# Altium schematic sheet 04_Analog_Part.SchDoc
size A2; SheetNumber: 4; SheetTotal: 5
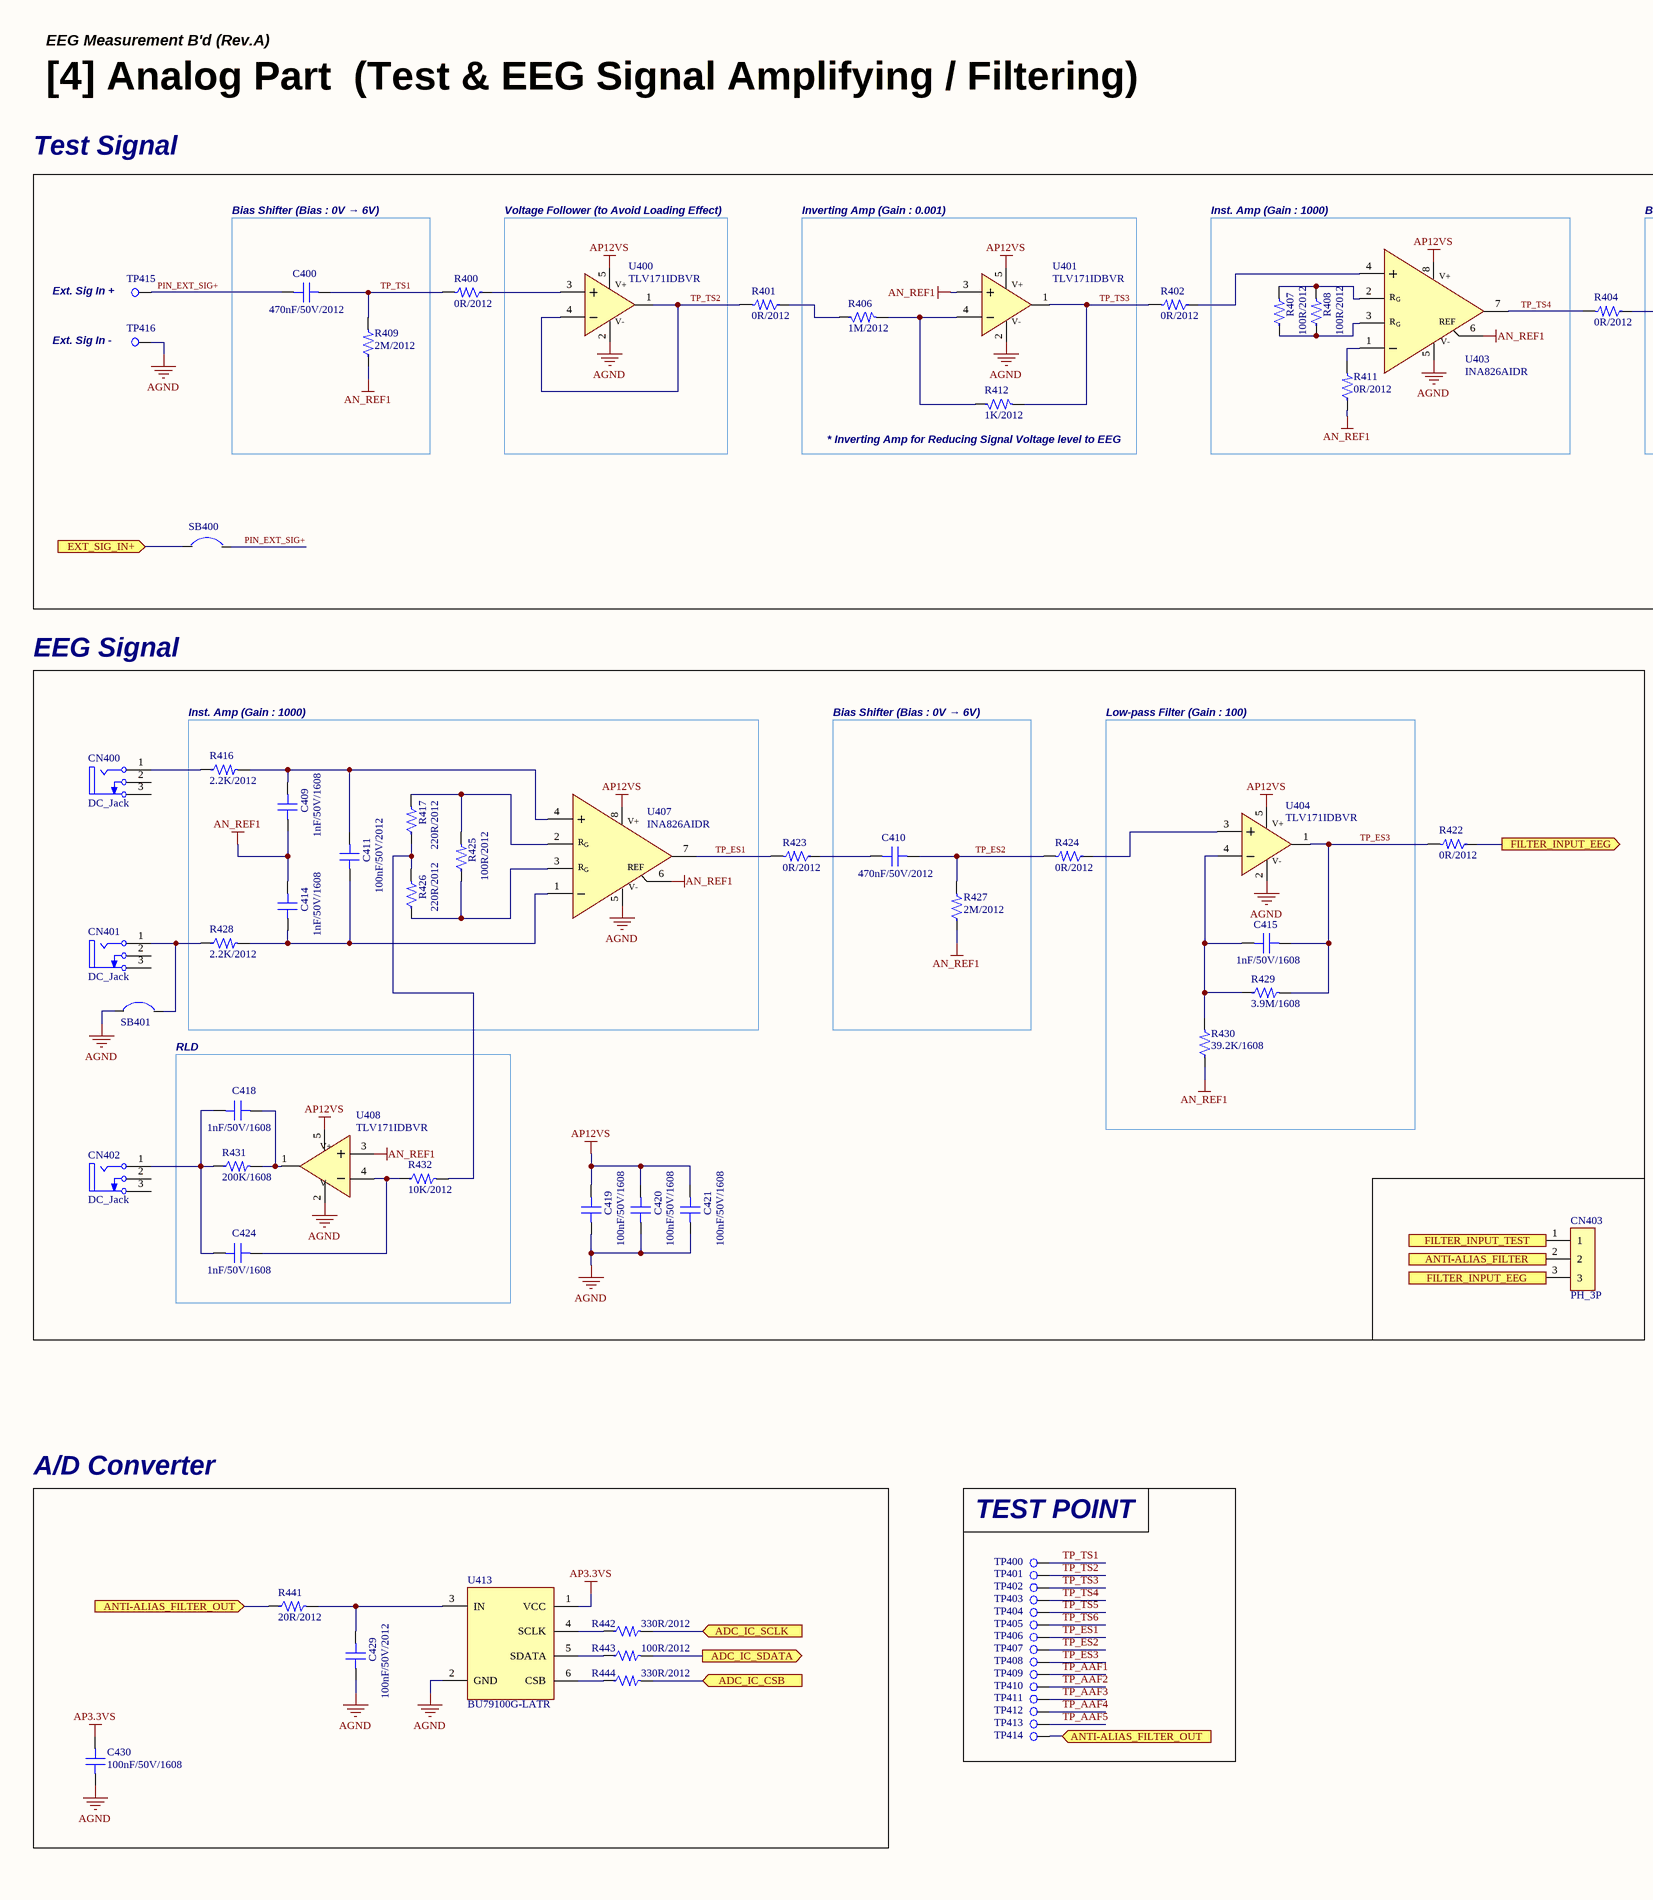
[diagram p0: 04_Analog_Part.SchDoc, left]
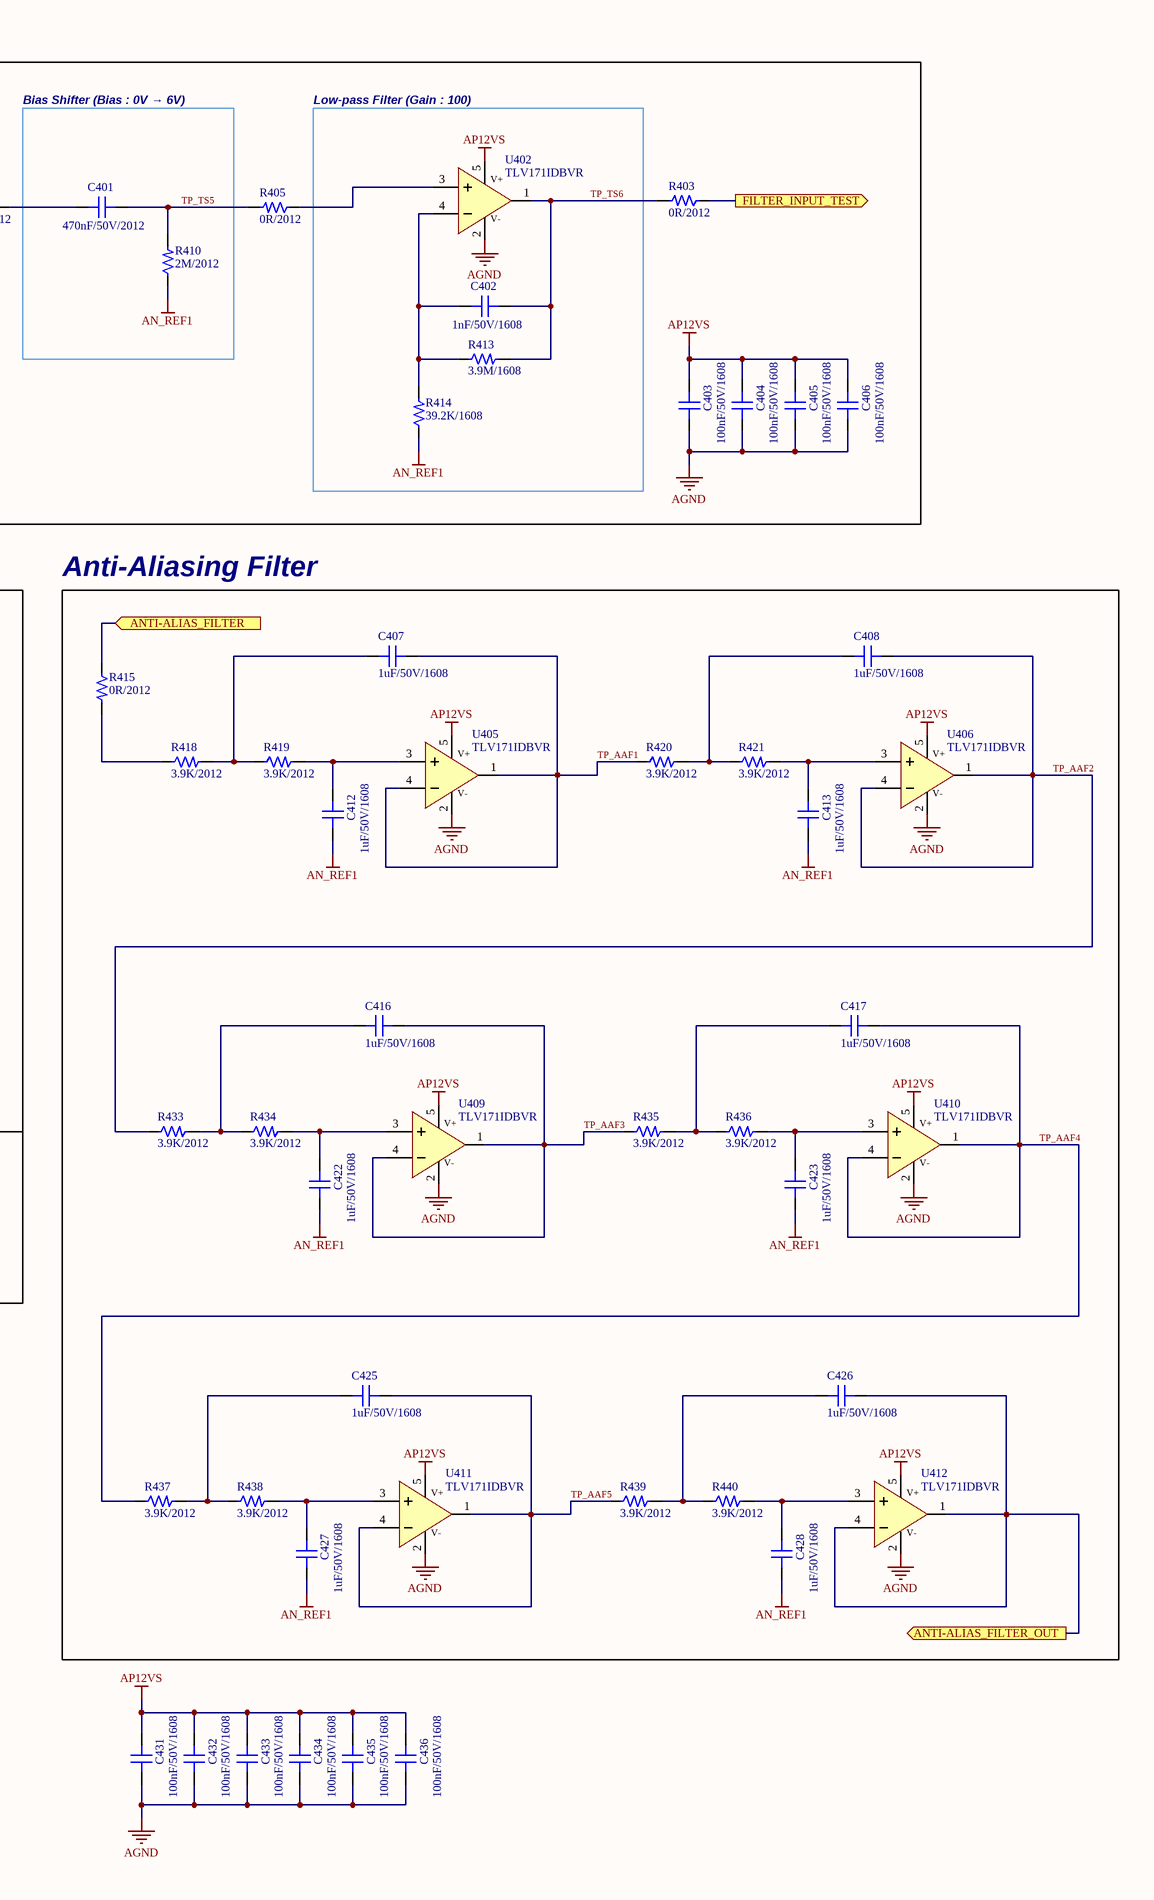
[diagram p1: 04_Analog_Part.SchDoc, right]

## Parts
C400  470nF/50V/2012  [CAP 2012 (0805_INCH)]
C401  470nF/50V/2012  [CAP 2012 (0805_INCH)]
C402  1nF/50V/1608  [CAP 1608 (0603_INCH)]
C403  100nF/50V/1608  [CAP 1608 (0603_INCH)]
C404  100nF/50V/1608  [CAP 1608 (0603_INCH)]
C405  100nF/50V/1608  [CAP 1608 (0603_INCH)]
C406  100nF/50V/1608  [CAP 1608 (0603_INCH)]
C407  1uF/50V/1608  [CAP 1608 (0603_INCH)]
C408  1uF/50V/1608  [CAP 1608 (0603_INCH)]
C409  1nF/50V/1608  [CAP 1608 (0603_INCH)]
C410  470nF/50V/2012  [CAP 2012 (0805_INCH)]
C411  100nF/50V/2012  [CAP 2012 (0805_INCH)]
C412  1uF/50V/1608  [CAP 1608 (0603_INCH)]
C413  1uF/50V/1608  [CAP 1608 (0603_INCH)]
C414  1nF/50V/1608  [CAP 1608 (0603_INCH)]
C415  1nF/50V/1608  [CAP 1608 (0603_INCH)]
C416  1uF/50V/1608  [CAP 1608 (0603_INCH)]
C417  1uF/50V/1608  [CAP 1608 (0603_INCH)]
C418  1nF/50V/1608  [CAP 1608 (0603_INCH)]
C419  100nF/50V/1608  [CAP 1608 (0603_INCH)]
C420  100nF/50V/1608  [CAP 1608 (0603_INCH)]
C421  100nF/50V/1608  [CAP 1608 (0603_INCH)]
C422  1uF/50V/1608  [CAP 1608 (0603_INCH)]
C423  1uF/50V/1608  [CAP 1608 (0603_INCH)]
C424  1nF/50V/1608  [CAP 1608 (0603_INCH)]
C425  1uF/50V/1608  [CAP 1608 (0603_INCH)]
C426  1uF/50V/1608  [CAP 1608 (0603_INCH)]
C427  1uF/50V/1608  [CAP 1608 (0603_INCH)]
C428  1uF/50V/1608  [CAP 1608 (0603_INCH)]
C429  100nF/50V/2012  [CAP 2012 (0805_INCH)]
C430  100nF/50V/1608  [CAP 1608 (0603_INCH)]
C431  100nF/50V/1608  [CAP 1608 (0603_INCH)]
C432  100nF/50V/1608  [CAP 1608 (0603_INCH)]
C433  100nF/50V/1608  [CAP 1608 (0603_INCH)]
C434  100nF/50V/1608  [CAP 1608 (0603_INCH)]
C435  100nF/50V/1608  [CAP 1608 (0603_INCH)]
C436  100nF/50V/1608  [CAP 1608 (0603_INCH)]
CN400  DC_Jack  [CON DC-Jack]
CN401  DC_Jack  [CON DC-Jack]
CN402  DC_Jack  [CON DC-Jack]
CN403  PH_3P  [CON PIN_HEADER-3PIN(2.54MM)]
R400  0R/2012  [RES 2012 (0805_inch)]
R401  0R/2012  [RES 2012 (0805_inch)]
R402  0R/2012  [RES 2012 (0805_inch)]
R403  0R/2012  [RES 2012 (0805_inch)]
R404  0R/2012  [RES 2012 (0805_inch)]
R405  0R/2012  [RES 2012 (0805_inch)]
R406  1M/2012  [RES 2012 (0805_inch)]
R407  100R/2012  [RES 2012 (0805_inch)]
R408  100R/2012  [RES 2012 (0805_inch)]
R409  2M/2012  [RES 2012 (0805_inch)]
R410  2M/2012  [RES 2012 (0805_inch)]
R411  0R/2012  [RES 2012 (0805_inch)]
R412  1K/2012  [RES 2012 (0805_inch)]
R413  3.9M/1608  [RES 1608 (0603_inch)]
R414  39.2K/1608  [RES 1608 (0603_inch)]
R415  0R/2012  [RES 2012 (0805_inch)]
R416  2.2K/2012  [RES 2012 (0805_inch)]
R417  220R/2012  [RES 2012 (0805_inch)]
R418  3.9K/2012  [RES 2012 (0805_inch)]
R419  3.9K/2012  [RES 2012 (0805_inch)]
R420  3.9K/2012  [RES 2012 (0805_inch)]
R421  3.9K/2012  [RES 2012 (0805_inch)]
R422  0R/2012  [RES 2012 (0805_inch)]
R423  0R/2012  [RES 2012 (0805_inch)]
R424  0R/2012  [RES 2012 (0805_inch)]
R425  100R/2012  [RES 2012 (0805_inch)]
R426  220R/2012  [RES 2012 (0805_inch)]
R427  2M/2012  [RES 2012 (0805_inch)]
R428  2.2K/2012  [RES 2012 (0805_inch)]
R429  3.9M/1608  [RES 1608 (0603_inch)]
R430  39.2K/1608  [RES 1608 (0603_inch)]
R431  200K/1608  [RES 1608 (0603_inch)]
R432  10K/2012  [RES 2012 (0805_inch)]
R433  3.9K/2012  [RES 2012 (0805_inch)]
R434  3.9K/2012  [RES 2012 (0805_inch)]
R435  3.9K/2012  [RES 2012 (0805_inch)]
R436  3.9K/2012  [RES 2012 (0805_inch)]
R437  3.9K/2012  [RES 2012 (0805_inch)]
R438  3.9K/2012  [RES 2012 (0805_inch)]
R439  3.9K/2012  [RES 2012 (0805_inch)]
R440  3.9K/2012  [RES 2012 (0805_inch)]
R441  20R/2012  [RES 2012 (0805_inch)]
R442  330R/2012  [RES 2012 (0805_inch)]
R443  100R/2012  [RES 2012 (0805_inch)]
R444  330R/2012  [RES 2012 (0805_inch)]
SB400  SB  [SB (Solder-Bridge)]  (value not drawn)
SB401  SB  [SB (Solder-Bridge)]  (value not drawn)
TP400  TP_HOLE(1MM)  [TP_HOLE(1MM)]  (value not drawn)
TP401  TP_HOLE(1MM)  [TP_HOLE(1MM)]  (value not drawn)
TP402  TP_HOLE(1MM)  [TP_HOLE(1MM)]  (value not drawn)
TP403  TP_HOLE(1MM)  [TP_HOLE(1MM)]  (value not drawn)
TP404  TP_HOLE(1MM)  [TP_HOLE(1MM)]  (value not drawn)
TP405  TP_HOLE(1MM)  [TP_HOLE(1MM)]  (value not drawn)
TP406  TP_HOLE(1MM)  [TP_HOLE(1MM)]  (value not drawn)
TP407  TP_HOLE(1MM)  [TP_HOLE(1MM)]  (value not drawn)
TP408  TP_HOLE(1MM)  [TP_HOLE(1MM)]  (value not drawn)
TP409  TP_HOLE(1MM)  [TP_HOLE(1MM)]  (value not drawn)
TP410  TP_HOLE(1MM)  [TP_HOLE(1MM)]  (value not drawn)
TP411  TP_HOLE(1MM)  [TP_HOLE(1MM)]  (value not drawn)
TP412  TP_HOLE(1MM)  [TP_HOLE(1MM)]  (value not drawn)
TP413  TP_HOLE(1MM)  [TP_HOLE(1MM)]  (value not drawn)
TP414  TP_HOLE(1MM)  [TP_HOLE(1MM)]  (value not drawn)
TP415  TP_HOLE(1MM)  [TP_HOLE(1MM)]  (value not drawn)
TP416  TP_HOLE(1MM)  [TP_HOLE(1MM)]  (value not drawn)
U400  TLV171IDBVR  [SOT-23-5 (TI DBV PACKAGE)]
U401  TLV171IDBVR  [SOT-23-5 (TI DBV PACKAGE)]
U402  TLV171IDBVR  [SOT-23-5 (TI DBV PACKAGE)]
U403  INA826AIDR  [IC_SOIC-8 (4.90x3.90mm)]
U404  TLV171IDBVR  [SOT-23-5 (TI DBV PACKAGE)]
U405  TLV171IDBVR  [SOT-23-5 (TI DBV PACKAGE)]
U406  TLV171IDBVR  [SOT-23-5 (TI DBV PACKAGE)]
U407  INA826AIDR  [IC_SOIC-8 (4.90x3.90mm)]
U408  TLV171IDBVR  [SOT-23-5 (TI DBV PACKAGE)]
U409  TLV171IDBVR  [SOT-23-5 (TI DBV PACKAGE)]
U410  TLV171IDBVR  [SOT-23-5 (TI DBV PACKAGE)]
U411  TLV171IDBVR  [SOT-23-5 (TI DBV PACKAGE)]
U412  TLV171IDBVR  [SOT-23-5 (TI DBV PACKAGE)]
U413  BU79100G-LATR  [IC_SOT-23-6]

## Blocks framed on the sheet
Test Signal: C403-C406 R400-R406 R412 SB400 TP415 TP416 U401
Bias Shifter (Bias : 0V → 6V): C400 R409
Voltage Follower (to Avoid Loading Effect): U400
Inst. Amp (Gain : 1000): R407 R408 R411 U403
Bias Shifter (Bias : 0V → 6V): C401 R410
Low-pass Filter (Gain : 100): C402 R413 R414 U402
EEG Signal: C419-C421 CN400-CN403 R422-R424 SB401
Anti-Aliasing Filter: C407 C408 C412 C413 C416 C417 C422 C423 C425-C428 R415 R418-R421 R433-R440 U405 U406 U409-U412
Inst. Amp (Gain : 1000): C409 C411 C414 R416 R417 R425 R426 R428 U407
Bias Shifter (Bias : 0V → 6V): C410 R427
Low-pass Filter (Gain : 100): C415 R429 R430 U404
RLD: C418 C424 R431 R432 U408
A/D Converter: C429 C430 R441-R444 U413
TEST POINT: TP400-TP414

## Ports
ADC_IC_CSB (in), ADC_IC_SCLK (in), ADC_IC_SDATA (out), ANTI-ALIAS_FILTER (in), ANTI-ALIAS_FILTER (out), ANTI-ALIAS_FILTER_OUT (in), ANTI-ALIAS_FILTER_OUT (out), EXT_SIG_IN+ (in), FILTER_INPUT_EEG (in), FILTER_INPUT_EEG (out), FILTER_INPUT_TEST (in), FILTER_INPUT_TEST (out)

## Nets
AGND: C403.1 C404.1 C405.1 C406.1 C419.1 C420.1 C421.1 C429.1 C430.1 C431.1 C432.1 C433.1 C434.1 C435.1 C436.1 SB401.1 TP416.1(TP) U400.2(V-) U401.2(V-) U402.2(V-) U403.5(V-) U404.2(V-) U405.2(V-) U406.2(V-) U407.5(V-) U408.2(V-) U409.2(V-) U410.2(V-) U411.2(V-) U412.2(V-) U413.2(GND)
AN_REF1: C409.1 C412.1 C413.1 C414.2 C422.1 C423.1 C427.1 C428.1 R409.1 R410.1 R411.1 R414.1 R427.1 R430.1 U401.3(IN+) U403.6(REF) U407.6(REF) U408.3(IN+)
AP3.3VS: C430.2 U413.1(VCC)
AP12VS: C403.2 C404.2 C405.2 C406.2 C419.2 C420.2 C421.2 C431.2 C432.2 C433.2 C434.2 C435.2 C436.2 U400.5(V+) U401.5(V+) U402.5(V+) U403.8(V+) U404.5(V+) U405.5(V+) U406.5(V+) U407.8(V+) U408.5(V+) U409.5(V+) U410.5(V+) U411.5(V+) U412.5(V+)
ADC_IC_CSB: R444.2 ; port ADC_IC_CSB
ADC_IC_SCLK: R442.2 ; port ADC_IC_SCLK
ADC_IC_SDATA: R443.2 ; port ADC_IC_SDATA
ANTI-ALIAS_FILTER: CN403.2 R415.1 ; port ANTI-ALIAS_FILTER
ANTI-ALIAS_FILTER_OUT: C426.2 R441.1 TP414.1(TP) U412.1(OUT) U412.4(IN-) ; port ANTI-ALIAS_FILTER_OUT
EXT_SIG_IN+: SB400.1 ; port EXT_SIG_IN+
FILTER_INPUT_EEG: CN403.3 R422.1 ; port FILTER_INPUT_EEG
FILTER_INPUT_TEST: CN403.1 R403.1 ; port FILTER_INPUT_TEST
PIN_EXT_SIG+: C400.1 SB400.2 TP415.1(TP)
TP_AAF1: C407.2 R420.1 TP409.1(TP) U405.1(OUT) U405.4(IN-)
TP_AAF2: C408.2 R433.1 TP410.1(TP) U406.1(OUT) U406.4(IN-)
TP_AAF3: C416.2 R435.1 TP411.1(TP) U409.1(OUT) U409.4(IN-)
TP_AAF4: C417.2 R437.1 TP412.1(TP) U410.1(OUT) U410.4(IN-)
TP_AAF5: C425.2 R439.1 TP413.1(TP) U411.1(OUT) U411.4(IN-)
TP_ES1: R423.2 TP406.1(TP) U407.7(VOUT)
TP_ES2: C410.2 R424.2 R427.2 TP407.1(TP)
TP_ES3: C415.1 R422.2 R429.2 TP408.1(TP) U404.1(OUT)
TP_TS1: C400.2 R400.2 R409.2 TP400.1(TP)
TP_TS2: R401.2 TP401.1(TP) U400.1(OUT) U400.4(IN-)
TP_TS3: R402.2 R412.2 TP402.1(TP) U401.1(OUT)
TP_TS4: R404.2 TP403.1(TP) U403.7(VOUT)
TP_TS5: C401.2 R405.2 R410.2 TP404.1(TP)
TP_TS6: C402.1 R403.2 R413.2 TP405.1(TP) U402.1(OUT)
NetC401_1: C401.1 R404.1
NetC402_2: C402.2 R413.1 R414.2 U402.4(IN-)
NetC407_1: C407.1 R418.2 R419.1
NetC408_1: C408.1 R420.2 R421.1
NetC409_2: C409.2 C411.2 R416.2 U407.4(IN+)
NetC410_1: C410.1 R423.1
NetC411_1: C411.1 C414.1 R428.2 U407.1(IN-)
NetC412_2: C412.2 R419.2 U405.3(IN+)
NetC413_2: C413.2 R421.2 U406.3(IN+)
NetC415_2: C415.2 R429.1 R430.2 U404.4(IN-)
NetC416_1: C416.1 R433.2 R434.1
NetC417_1: C417.1 R435.2 R436.1
NetC418_1: C418.1 R431.2 U408.1(OUT)
NetC418_2: C418.2 C424.2 CN402.1(VCC) R431.1
NetC422_2: C422.2 R434.2 U409.3(IN+)
NetC423_2: C423.2 R436.2 U410.3(IN+)
NetC424_1: C424.1 R432.1 U408.4(IN-)
NetC425_1: C425.1 R437.2 R438.1
NetC426_1: C426.1 R439.2 R440.1
NetC427_2: C427.2 R438.2 U411.3(IN+)
NetC428_2: C428.2 R440.2 U412.3(IN+)
NetC429_2: C429.2 R441.2 U413.3(IN)
NetCN400_1: CN400.1(VCC) R416.1
NetCN401_1: CN401.1(VCC) R428.1 SB401.2
NetR400_1: R400.1 U400.3(IN+)
NetR401_1: R401.1 R406.1
NetR402_1: R402.1 U403.4(IN+)
NetR405_1: R405.1 U402.3(IN+)
NetR406_2: R406.2 R412.1 U401.4(IN-)
NetR407_1: R407.1 R408.1 U403.3(RG-)
NetR407_2: R407.2 R408.2 U403.2(RG+)
NetR411_2: R411.2 U403.1(IN-)
NetR415_2: R415.2 R418.1
NetR417_1: R417.1 R426.2 R432.2
NetR417_2: R417.2 R425.2 U407.2(RG+)
NetR424_1: R424.1 U404.3(IN+)
NetR425_1: R425.1 R426.1 U407.3(RG-)
NetR442_1: R442.1 U413.4(SCLK)
NetR443_1: R443.1 U413.5(SDATA)
NetR444_1: R444.1 U413.6(CSB)

Not connected (* = marked no-connect by the designer): CN400 2(GND) 3(GND); CN401 2(GND) 3(GND); CN402 2(GND) 3(GND)

## Notes on the sheet
- EEG Measurement B'd (Rev.A)
- [4] Analog Part  (Test & EEG Signal Amplifying / Filtering)
- Inverting Amp (Gain : 0.001)
- (near TP415) Ext. Sig In +
- (near TP416) Ext. Sig In -
- (near R412) * Inverting Amp for Reducing Signal Voltage level to EEG
- Title
- Rev
- Doc
- Sheet #
- of
- Author
- This document is copyright of ArkX and shall not be revealed, produced, copied, in whole or in part,
- Date
- nor used for any purpose other than submitted.
- (in symbol IC_INST-AMP_INA826AIDR) R; G

## Library data of the parts
C400 C401 C410 = CAP_470nF/50V/2012: Ceramic CAP_470nF/50V/2012; LCSC Part #: C13967; JLCPCB Part Type: Basic Part
C402 C409 C414 C415 C418 C424 = CAP_1nF/50V/1608: Ceramic CAP_1nF/50V/1608; LCSC Part #: C1588; JLCPCB Part Type: Basic Part
C403-C406 C419-C421 C430-C436 = CAP_100nF/50V/1608: Ceramic CAP_100nF/50V/1608; LCSC Part #: C14663; JLCPCB Part Type: Basic Part
C407 C408 C412 C413 C416 C417 C422 C423 C425-C428 = CAP_1uF/50V/1608: Ceramic CAP_1uF/50V/1608; LCSC Part #: C15849; JLCPCB Part Type: Basic Part
C411 C429 = CAP_100nF/50V/2012: Ceramic CAP_100nF/50V/2012; LCSC Part #: C49678; JLCPCB Part Type: Basic Part
CN400-CN402 = CON_DC-Jack: ComponentLink1Description: Manufacturer Link; ComponentLink1URL: http://www.cliffuk.co.uk/
CN403 = CON_PIN_HEADER_SINGLE-3PIN(2.54MM)
R400-R405 R411 R415 R422-R424 = RES_0R/2012/0.125W: Value: 0R; Power Rating: 0.125W; Precision: 1%; Size: 2012; LCSC Part #: C17477; JLCPCB Part Type: Basic Part
R406 = RES_1M/2012/0.125W: Value: 1M; Power Rating: 0.125W; Precision: 1%; Size: 2012; LCSC Part #: C17514; JLCPCB Part Type: Basic Part
R407 R408 R425 R443 = RES_100R/2012/0.125W: Value: 100R; Power Rating: 0.125W; Precision: 1%; Size: 2012; LCSC Part #: C17408; JLCPCB Part Type: Basic Part
R409 R410 R427 = RES_2M/2012/0.125W: Value: 2M; Power Rating: 0.125W; Precision: 1%; Size: 2012; LCSC Part #: C26112; JLCPCB Part Type: Basic Part
R412 = RES_1K/2012/0.125W: Value: 1K; Power Rating: 0.125W; Precision: 1%; Size: 2012; LCSC Part #: C17513; JLCPCB Part Type: Basic Part
R413 R429 = RES_3.9M/1608/0.1W: Value: 3.9M; Power Rating: 0.1W; Precision: 1%; Size: 1608; LCSC Part #: C227875; JLCPCB Part Type: Extended Part
R414 R430 = RES_39.2K/1608/0.1W: Value: 39.2K; Power Rating: 0.1W; Precision: 1%; Size: 1608; LCSC Part #: C137734; JLCPCB Part Type: Extended Part
R416 R428 = RES_2.2K/2012/0.125W: Value: 2.2K; Power Rating: 0.125W; Precision: 1%; Size: 2012; LCSC Part #: C17520; JLCPCB Part Type: Basic Part
R417 R426 = RES_220R/2012/0.125W: Value: 220R; Power Rating: 0.125W; Precision: 1%; Size: 2012; LCSC Part #: C17557; JLCPCB Part Type: Basic Part
R418-R421 R433-R440 = RES_3.9K/2012/0.125W: Value: 3.9K; Power Rating: 0.125W; Precision: 1%; Size: 2012; LCSC Part #: C17614; JLCPCB Part Type: Basic Part
R431 = RES_200K/1608/0.1W: Value: 200K; Power Rating: 0.1W; Precision: 1%; Size: 1608; LCSC Part #: C25811; JLCPCB Part Type: Basic Part
R432 = RES_10K/2012/0.125W: Value: 10K; Power Rating: 0.125W; Precision: 1%; Size: 2012; LCSC Part #: C17414; JLCPCB Part Type: Basic Part
R441 = RES_20R/2012/0.125W: Value: 20R; Power Rating: 0.125W; Precision: 1%; Size: 2012; LCSC Part #: C17544; JLCPCB Part Type: Basic Part
R442 R444 = RES_330R/2012/0.125W: Value: 330R; Power Rating: 0.125W; Precision: 1%; Size: 2012; LCSC Part #: C17630; JLCPCB Part Type: Basic Part
SB400 SB401 = SB_Solder-Bridge
U400-U402 U404-U406 U408-U412 = IC_OPAMP_TLV171IDBVR: Single, 36-V, 3-MHz, low-power operational amplifier for cost-sensitive applications; LCSC Part #: C2864299; JLCPCB Part Type: Extended Part
U403 U407 = IC_INST-AMP_INA826AIDR: 35nA 40uV 1MHz Single SOIC-8  Instrumentation OpAmps ROHS; LCSC Part #: C38433; JLCPCB Part Type: Extended Part
U413 = IC_ADC_BU79100G-LATR: Successive Approximation A/D Converter / 12 bit, 0.5 MSPS to 1 MSPS, 2.7 V to 5.25 V, / 1-channel, SPI Interface; LCSC Part #: None; JLCPCB Part Type: None